# EAGLE design T01_Synth_Glove_Prototype_Board (EAGLE 7.1.0)
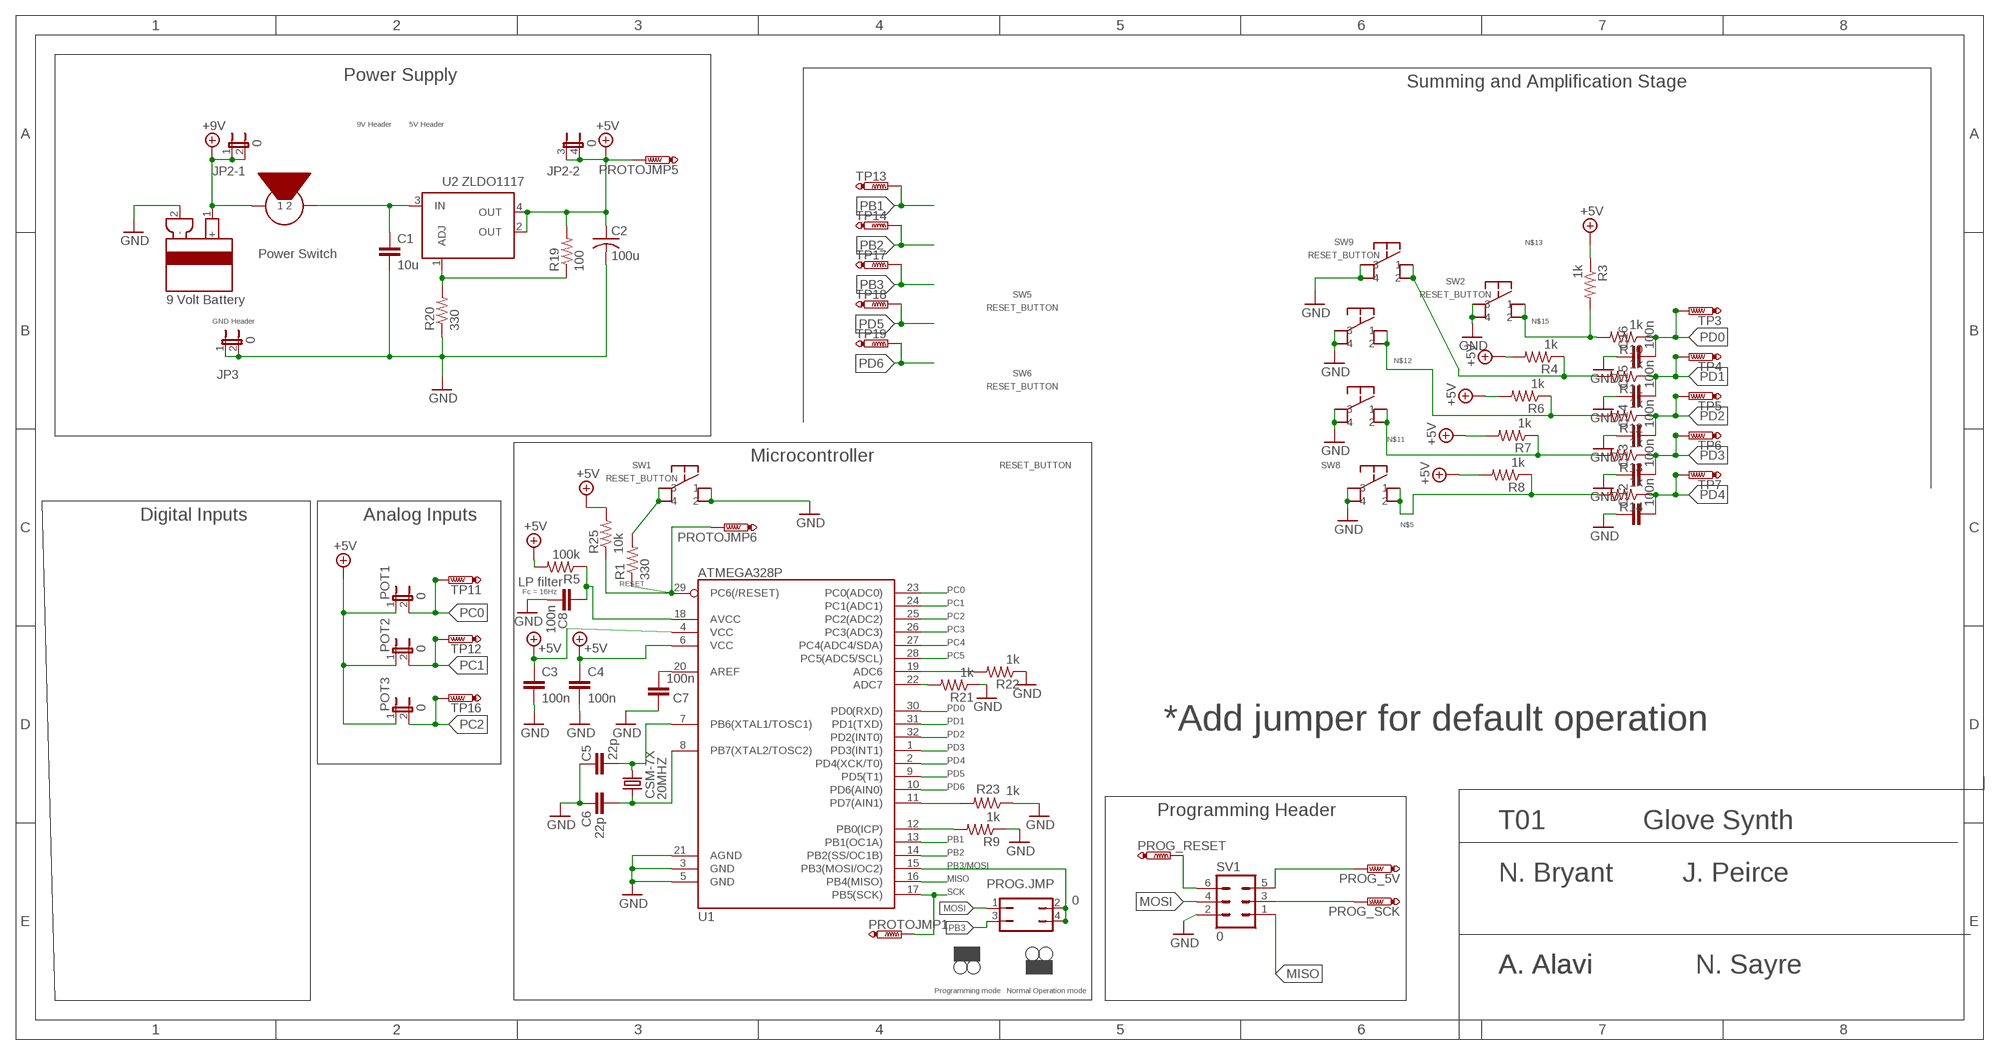
[diagram p0: schematic, sheet 1]

## Parts
20MHZ  CSM-7X  CSM-7X-DU  [CSM-7X-DU]
C1  10u  CAP0603-CAP  [0603-CAP]
C2  100u  C-US075-042X103  [C075-042X103]
C3  100n  CAP0603-CAP  [0603-CAP]
C4  100n  CAP0603-CAP  [0603-CAP]
C5  22p  CAP0603-CAP  [0603-CAP]
C6  22p  CAP0603-CAP  [0603-CAP]
C7  100n  CAP0603-CAP  [0603-CAP]
C8  100n  CAP0603-CAP  [0603-CAP]
C12  100n  CAP0603-CAP  [0603-CAP]
C13  100n  CAP0603-CAP  [0603-CAP]
C14  100n  CAP0603-CAP  [0603-CAP]
C15  100n  CAP0603-CAP  [0603-CAP]
C16  100n  CAP0603-CAP  [0603-CAP]
JP2  0  JP2QE  [JP2Q]
JP3  0  JP1E  [JP1]
POT1  0  JP1E  [JP1]
POT2  0  JP1E  [JP1]
POT3  0  JP1E  [JP1]
PROG.JMP  0  JP2Q  [JP2Q]
PROG_5V  PTR1B2,54  [B2,54]
PROG_RESET  PTR1B2,54  [B2,54]
PROG_SCK  PTR1B2,54  [B2,54]
PROTOJMP1  PTR1B2,54  [B2,54]
PROTOJMP5  PTR1B2,54  [B2,54]
PROTOJMP6  PTR1B2,54  [B2,54]
R1  330  RESISTOR0603  [0603-RES]
R3  1k  RESISTOR0603  [0603-RES]
R4  1k  RESISTOR0603  [0603-RES]
R5  100k  RESISTOR0603  [0603-RES]
R6  1k  RESISTOR0603  [0603-RES]
R7  1k  RESISTOR0603  [0603-RES]
R8  1k  RESISTOR0603  [0603-RES]
R9  1k  RESISTOR0603  [0603-RES]
R10  1k  RESISTOR0603  [0603-RES]
R11  1k  RESISTOR0603  [0603-RES]
R12  1k  RESISTOR0603  [0603-RES]
R13  1k  RESISTOR0603  [0603-RES]
R14  1k  RESISTOR0603  [0603-RES]
R19  100  RESISTOR0603  [0603-RES]
R20  330  RESISTOR0603  [0603-RES]
R21  1k  RESISTOR0603  [0603-RES]
R22  1k  RESISTOR0603  [0603-RES]
R23  1k  RESISTOR0603  [0603-RES]
R25  10k  RESISTOR0603  [0603-RES]
SV1  0  MA03-2  [MA03-2]
SW1  RESET_BUTTON  [RESET_BUTTON]
SW2  RESET_BUTTON  [RESET_BUTTON]
SW5  RESET_BUTTON  [RESET_BUTTON]
SW6  RESET_BUTTON  [RESET_BUTTON]
SW8  RESET_BUTTON  [RESET_BUTTON]
SW9  RESET_BUTTON  [RESET_BUTTON]
TP3  PTR1B2,54  [B2,54]
TP4  PTR1B2,54  [B2,54]
TP5  PTR1B2,54  [B2,54]
TP6  PTR1B2,54  [B2,54]
TP7  PTR1B2,54  [B2,54]
TP11  PTR1B2,54  [B2,54]
TP12  PTR1B2,54  [B2,54]
TP13  PTR1B2,54  [B2,54]
TP14  PTR1B2,54  [B2,54]
TP16  PTR1B2,54  [B2,54]
TP17  PTR1B2,54  [B2,54]
TP18  PTR1B2,54  [B2,54]
TP19  PTR1B2,54  [B2,54]
U1  ATMEGA328P  ATMEGA328_SMT  [TQFP32-08]
U2  ZLDO1117  [SOT223]
U$7  POWER_SWITCH  [JP1]
U$8  9VOLTBATTERY  [JP1]

## Nets
+5V: C2.1 C3.1 C4.1 JP2.3 JP2.4 POT1.1 POT2.1 POT3.1 PROTOJMP5.TP R3.1 R4.2 R5.2 R6.2 R7.2 R8.2 R19.2 R25.2 U1.4(VCC) U1.6(VCC) U2.2(OUT) U2.4(OUT)
+9V: JP2.1 JP2.2 U$7.1 U$8.1(+)
GND: C1.2 C2.2 C3.2 C4.2 C5.2 C6.2 C7.2 C8.2 C12.1 C13.1 C14.1 C15.1 C16.1 JP3.1 JP3.2 R9.1 R20.1 R21.1 R22.1 R23.1 SV1.2 SW1.1 SW1.2 SW2.3 SW2.4 SW5.3 SW5.4 SW6.3 SW6.4 SW8.3 SW8.4 SW9.3 SW9.4 U1.3(GND) U1.5(GND) U1.21(AGND) U$8.2(-)
JP3: PROG_SCK.TP SV1.3
MISO: SV1.1 U1.16(PB4(MISO))
MOSI: PROG.JMP.1 SV1.4
N$1: C7.1 U1.20(AREF)
N$2: PROG_5V.TP SV1.5
N$5: R8.1 R14.2 SW8.1 SW8.2
N$6: 20MHZ.1 C5.1 U1.7(PB6(XTAL1/TOSC1))
N$7: 20MHZ.2 C6.1 U1.8(PB7(XTAL2/TOSC2))
N$8: C8.1 R5.1 U1.18(AVCC)
N$9: R21.2 U1.22(ADC7)
N$10: R22.2 U1.19(ADC6)
N$11: R7.1 R13.2 SW6.1 SW6.2
N$12: R6.1 R12.2 SW5.1 SW5.2
N$13: R4.1 R11.2 SW9.1 SW9.2
N$15: R3.2 R10.2 SW2.1 SW2.2
N$17: R9.2 U1.12(PB0(ICP))
N$22: R1.2 SW1.3 SW1.4
N$37: R19.1 R20.2 U2.1(ADJ)
N$38: C1.1 U2.3(IN) U$7.2
PB1: TP13.TP U1.13(PB1(OC1A))
PB2: TP14.TP U1.14(PB2(SS/OC1B))
PB3: PROG.JMP.3 TP17.TP
PB3/MOSI: PROG.JMP.2 PROG.JMP.4 U1.15(PB3(MOSI/OC2))
PC0: POT1.2 TP11.TP U1.23(PC0(ADC0))
PC1: POT2.2 TP12.TP U1.24(PC1(ADC1))
PC2: POT3.2 TP16.TP U1.25(PC2(ADC2))
PC3: U1.26(PC3(ADC3))
PC4: U1.27(PC4(ADC4/SDA))
PC5: U1.28(PC5(ADC5/SCL))
PD0: C16.2 R10.1 TP3.TP U1.30(PD0(RXD))
PD1: C15.2 R11.1 TP4.TP U1.31(PD1(TXD))
PD2: C14.2 R12.1 TP5.TP U1.32(PD2(INT0))
PD3: C13.2 R13.1 TP6.TP U1.1(PD3(INT1))
PD4: C12.2 R14.1 TP7.TP U1.2(PD4(XCK/T0))
PD5: TP18.TP U1.9(PD5(T1))
PD6: TP19.TP U1.10(PD6(AIN0))
PD7: R23.2 U1.11(PD7(AIN1))
PJ4: PROG_RESET.TP SV1.6
RESET: PROTOJMP6.TP R1.1 R25.1 U1.29(PC6(/RESET))
SCK: PROTOJMP1.TP U1.17(PB5(SCK))

## Notes on the sheet
- Power Supply
- Summing and Amplification Stage
- 9V Header | 5V Header
- Power Switch
- GND Header
- Microcontroller
- Digital Inputs | Analog Inputs
- LP filter
- Fc = 16Hz
- *Add jumper for default operation
- Programming Header
- T01 | Glove Synth
- N. Bryant | J. Peirce
- A. Alavi | A. Alavi | N. Sayre
- Programming mode | Normal Operation mode

## Library data of the parts
20MHZ = crystal:CSM-7X-DU: SMD CRYSTAL Source: www.ecsxtal.com .. Crystal 3.6864MHz CSM_7X_DU.PDF; OC_FARNELL: unknown; OC_NEWARK: unknown
C1 C3-C8 C12-C16 = SparkFun-Capacitors:CAP: Capacitor Standard 0603 ceramic capacitor, and 0.1" leaded capacitor.
C2 = adafruit:C-US: CAPACITOR, American symbol
JP2 = jumper:JP2QE: JUMPER
JP3 POT1-POT3 = jumper:JP1E: JUMPER
PROG.JMP = jumper:JP2Q: JUMPER
PROG_5V PROG_RESET PROG_SCK PROTOJMP1 PROTOJMP5 PROTOJMP6 TP3-TP7 TP11-TP14 TP16-TP19 = testpad:PTR1: TEST PIN
R1 R3-R14 R19-R23 R25 = SparkFun-Resistors:RESISTOR: Resistor Basic schematic elements and footprints for 0603, 1206, and PTH resistors.
SV1 = con-lstb:MA03-2: PIN HEADER; OC_FARNELL: unknown; OC_NEWARK: unknown
SW1 SW2 SW5 SW6 SW8 SW9 = Synth_Glove:RESET_BUTTON
U1 = SparkFun-DigitalIC:ATMEGA328_SMT: 32-Pin Atmega328 part Commonly used on Arduino compatible boards Available in QFP and QFN packages TQFP is IC-09069 QFN is non-stock; PROD_ID: IC-09069
U2 = Synth_Glove:ZLDO1117
U$7 = Synth_Glove:POWER_SWITCH
U$8 = Synth_Glove:9VOLTBATTERY

## Board
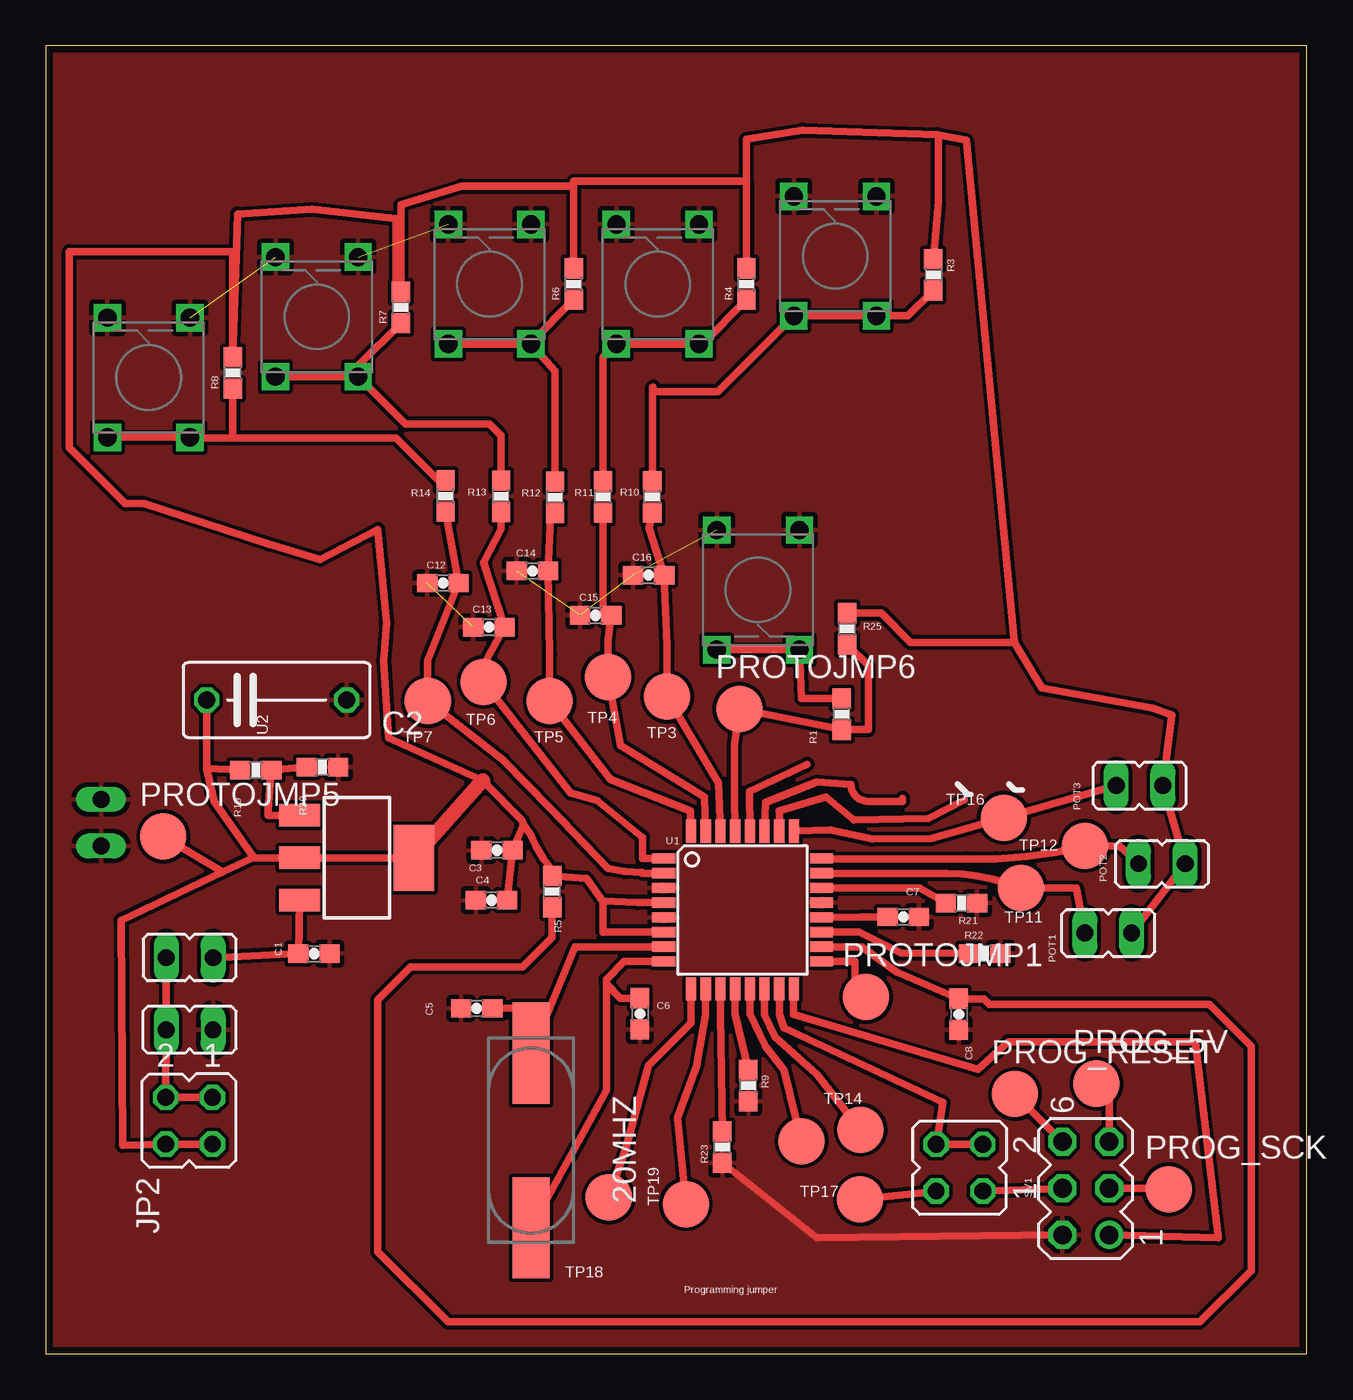
[diagram p1: board, top side]
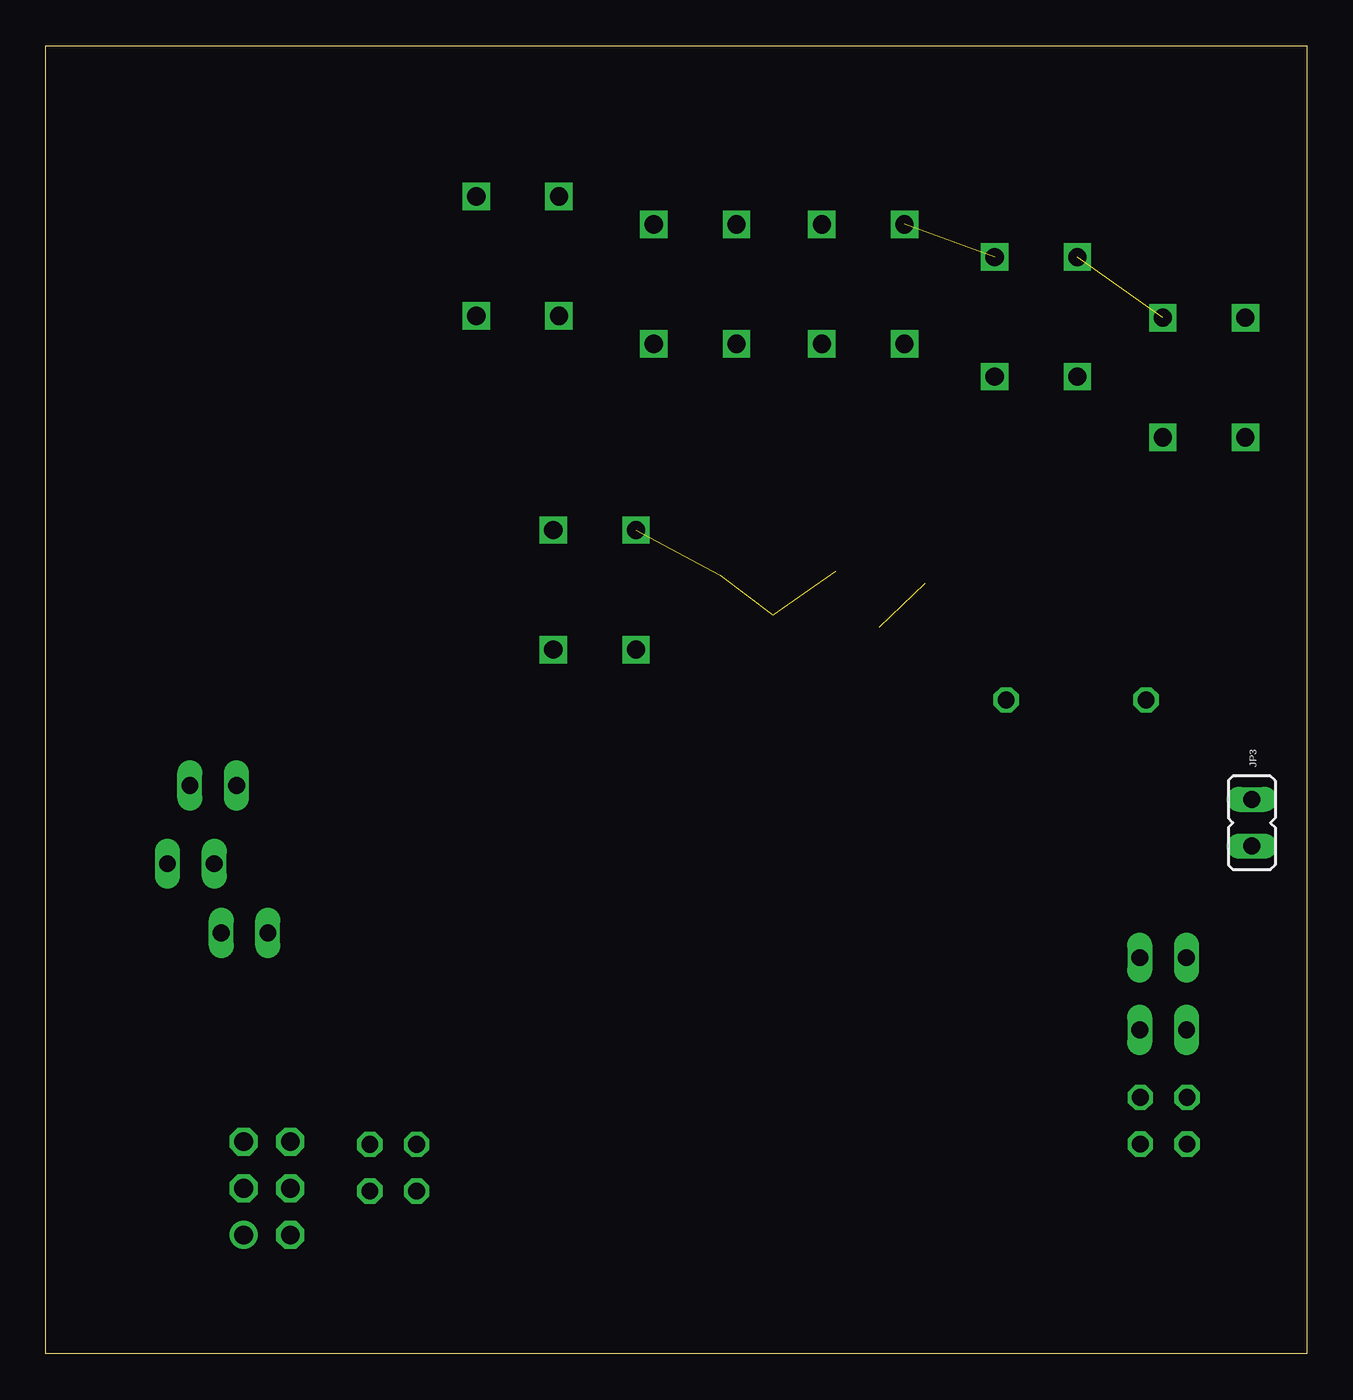
[diagram p2: board, bottom side, seen from below]

Size 68.58 x 71.12 mm. Coordinates in mm from the lower left corner, seen from the top.
Outline: 0,0 68.58,0 68.58,71.12 0,71.12 0,0
Copper layers (1*16): Top 0.0178mm / dielectric 59mil / Bottom 0.0178mm
Design rules "epl-lpkf": minimum track width 8mil, minimum drill 0.35mm, track to track 8mil, track to pad 8mil, pad to pad 8mil, via to via 8mil, smd to smd 8mil, copper to edge 15mil, drill to drill 15mil, minimum pad ring 8mil, minimum via ring 8mil, stop-mask expansion 3mil, vias tented up to drill 0mil, thermal gap 10mil

### Footprints (pad centres in the part's own frame; a part is rotated, then mirrored left to right if it is on the bottom)
CSM-7X-DU = smd 5.5 x 2: 1 -4.75,0; 2 4.75,0
0603-CAP = smd 1.1 x 1: 1 -0.85,0; 2 0.85,0
C075-042X103 = drill 0.914 octagon: 1 -3.81,0; 2 3.81,0
JP2Q = drill 0.914 octagon: 1 -1.27,-1.27; 2 1.27,-1.27; 3 -1.27,1.27; 4 1.27,1.27
JP1 = drill 0.914 long: 1 0,-1.27; 2 0,1.27
B2,54 = smd 2.54 x 2.54: TP 0,0
0603-RES = smd 1.1 x 1: 1 -0.85,0; 2 0.85,0
MA03-2 = drill 1.016: 1 -2.54,-1.27 | drill 1.016 octagon: 2 -2.54,1.27; 3 0,-1.27; 4 0,1.27; 5 2.54,-1.27; 6 2.54,1.27
RESET_BUTTON = drill 0.991 square: 1 3.251,2.248; 2 3.251,-2.248; 3 -3.251,2.248; 4 -3.251,-2.248
TQFP32-08 = smd 1.27 x 0.559: 1 -4.293,2.8; 2 -4.293,2; 3 -4.293,1.2; 4 -4.293,0.4; 5 -4.293,-0.4; 6 -4.293,-1.2; 7 -4.293,-2; 8 -4.293,-2.8; 17 4.293,-2.8; 18 4.293,-2; 19 4.293,-1.2; 20 4.293,-0.4; 21 4.293,0.4; 22 4.293,1.2; 23 4.293,2; 24 4.293,2.8 | smd 0.559 x 1.27: 9 -2.8,-4.293; 10 -2,-4.293; 11 -1.2,-4.293; 12 -0.4,-4.293; 13 0.4,-4.293; 14 1.2,-4.293; 15 2,-4.293; 16 2.8,-4.293; 25 2.8,4.293; 26 2,4.293; 27 1.2,4.293; 28 0.4,4.293; 29 -0.4,4.293; 30 -1.2,4.293; 31 -2,4.293; 32 -2.8,4.293
SOT223 = smd 1.219 x 2.235: 1 -2.311,-3.099; 2 0,-3.099; 3 2.311,-3.099 | smd 3.6 x 2.2: 4 0,3.099

### Placement (x,y rotation side)
20MHZ  26.38,11.59 270 top
C1  14.58,21.75 0 top
C2  12.55,35.55 0 top
C3  24.53,27.38 180 top
C4  24.23,24.66 180 top
C5  23.43,18.77 180 top
C6  32.3,18.48 270 top
C7  46.63,23.75 0 top
C8  49.65,18.45 270 top
C12  21.59,41.91 0 top
C13  24.09,39.51 0 top
C14  26.46,42.57 0 top
C15  29.89,40.16 0 top
C16  32.78,42.33 0 top
JP2  7.79,12.66 180 top
JP3  3,28.87 0 bottom
POT1  57.78,22.88 90 top
POT2  60.7,26.65 90 top
POT3  59.48,30.9 90 top
PROG.JMP  49.69,10.11 90 top
PROG_5V  57.14,14.68 0 top
PROG_RESET  52.71,14.12 0 top
PROG_SCK  61.07,8.93 0 top
PROTOJMP1  44.61,19.4 0 top
PROTOJMP5  6.38,28.12 0 top
PROTOJMP6  37.71,35.07 0 top
R1  43.29,34.78 90 top
R3  48.26,58.67 270 top
R4  38.1,58.17 90 top
R5  27.53,25.13 90 top
R6  28.7,58.17 90 top
R7  19.3,56.9 90 top
R8  10.16,53.34 90 top
R9  38.21,14.57 90 top
R10  32.98,46.59 90 top
R11  30.3,46.59 90 top
R12  27.69,46.58 90 top
R13  24.75,46.63 90 top
R14  21.74,46.64 90 top
R19  11.41,31.73 180 top
R20  15.04,31.89 180 top
R21  49.8,24.5 180 top
R22  51.06,21.75 180 top
R23  36.79,11.22 90 top
R25  43.58,39.41 90 top
SV1  56.56,8.98 90 top
SW1  38.73,41.54 90 top
SW2  42.93,59.69 270 top
SW5  24.13,58.17 270 top
SW6  14.73,56.39 270 top
SW8  5.59,53.09 270 top
SW9  33.27,58.17 270 top
TP3  33.79,35.73 180 top
TP4  30.56,36.8 180 top
TP5  27.4,35.49 180 top
TP6  23.81,36.53 180 top
TP7  20.77,35.49 180 top
TP11  53.03,25.32 0 top
TP12  56.51,27.61 0 top
TP13  41.09,11.55 0 top
TP14  44.31,12.17 0 top
TP16  52.1,29.13 0 top
TP17  44.28,8.38 0 top
TP18  30.61,8.5 0 top
TP19  34.8,8.13 0 top
U1  37.89,24.13 0 top
U2  16.9,26.96 270 top
U$7  7.82,21.53 270 top
U$8  7.81,17.61 270 top

### Tracks (layer width: path | path; a pad name or v marks a point on that pad's centre or on a via)
+5V
  Top 0.406: U1.4 32.16,24.53 30.28,24.61 | 30.28,24.61 29.4,25.85 R5.2 27.74,26.05 27.06,26.91 26.65,27.59 26.38,28.17 25.96,28.78 | 25.96,28.78 25.91,29 23.75,31.16 18.65,33.49 18.36,37.67 18.53,39.73 18.04,44.83 14.91,43.19 12.12,44.02 5.33,46.23 4.32,46.23 1.27,49.28 1.27,59.94 10.16,59.94 R8.2 10.41,61.98 14.48,62.23 19.05,61.72 19.05,58 R7.2 19.3,62.48 22.61,63.5 28.7,63.5 | 25.96,28.78 C3.1 C4.1 | 11.23,26.96 U2.2 U2.4 | 11.23,26.96 11.23,27.06 9.14,30.02 8.73,31.82 | 8.73,31.82 C2.1 | R19.2 8.73,31.82 | 11.23,26.96 9.62,26.2 | 9.62,26.2 4.08,23.56 4.17,11.31 JP2.4 JP2.3 | PROTOJMP5.TP 9.62,26.2 | 52.68,38.67 50.06,65.99 48.48,66.29 | 52.68,38.67 54.17,36.2 60.17,35.12 61.23,34.74 POT3.1 POT2.1 POT1.1 | U1.6 30.32,22.93 30.31,22.91 30.31,24.58 30.28,24.61 | R25.2 45.43,40.26 47.03,38.67 52.68,38.67 | 28.7,63.5 28.7,63.75 38.1,63.75 | 28.7,63.5 R6.2 | 38.1,63.75 R4.2 | R3.1 48.53,62.63 48.53,66.25 48.48,66.29 | 38.1,63.75 38.1,66.04 41.15,66.55 48.48,66.29
  Top 0.813: U2.4 23.75,31.16
+9V
  Top 0.406: U$7.1 U$8.1 JP2.2 JP2.1
GND  (6 unrouted)
  Top 0.406: R23.1 41.93,6.29 SV1.2
  pour Top: 0,0 68.58,0 68.58,71.12 0,71.12
JP3
  Top 0.406: SV1.3 61.01,8.98 PROG_SCK.TP
MISO
  Top 0.406: U1.16 40.67,19.83 40.67,18.45 50.69,15.45 52.34,16.96 62.5,16.96 63.77,6.29 SV1.1
MOSI
  Top 0.406: PROG.JMP.1 SV1.4
N$1
  Top 0.406: U1.20 44.36,23.75 C7.1
N$2
  Top 0.406: SV1.5 57.83,14 PROG_5V.TP
N$5
  Top 0.406: SW8.2 SW8.1 7.89,49.78 10.16,49.78 | R14.2 21.34,47.49 19.05,49.78 10.16,49.78 | R8.1 10.16,49.78
N$6
  Top 0.406: U1.7 28.79,22.13 20MHZ.1 26.42,18.84 C5.1
N$7
  Top 0.406: U1.8 31.44,21.33 30.48,20.36 30.48,20.11 | 30.48,20.11 30.48,14.31 20MHZ.2 | C6.1 31.26,19.33 30.48,20.11
N$8
  Top 0.406: U1.18 44.39,22.11 46.25,20.77 C8.1 51.02,19.3 51.33,18.99 63.26,18.99 65.55,16.7 65.55,4.51 62.76,1.72 21.86,1.72 18.05,5.53 18.05,19.24 19.83,21.02 25.93,21.02 27.53,22.63 R5.1
N$9
  Top 0.406: U1.22 44.7,25.32 47.52,25.34 R21.2
N$10
  Top 0.406: U1.19 44.22,22.94 46.5,21.78 R22.2
N$11
  Top 0.406: SW6.2 SW6.1 | R13.2 24.75,49.92 24.13,50.55 19.57,50.55 SW6.1 | SW6.1 16.98,53.72 R7.1
N$12
  Top 0.406: SW5.2 SW5.1 | R12.2 27.69,53.43 SW5.1 | SW5.1 26.38,54.99 R6.1
N$13
  Top 0.406: R11.2 30.3,54.19 SW9.2 SW9.1 35.7,54.91 R4.1
N$15
  Top 0.406: R10.2 32.98,52.32 | 32.98,52.32 32.98,52.53 33.02,52.58 | 32.98,52.32 36.56,52.32 SW2.2 SW2.1 46.88,56.44 R3.2
N$17
  Top 0.406: U1.12 37.49,18.47 R9.2
N$22
  Top 0.406: SW1.3 SW1.4 41.1,35.63 R1.2
N$37
  Top 0.406: U2.1 12.08,29.27 12.08,29.58 R19.1 R20.2
N$38
  Top 0.406: U2.3 C1.1 U$7.2
PB1
  Top 0.406: U1.13 38.28,18.47 39.13,16.7 40.15,15.43 TP13.TP
PB2
  Top 0.406: U1.14 | U1.14 39.09,18.43 39.64,17.21 41.93,15.18 TP14.TP
PB3
  Top 0.406: PROG.JMP.3 TP17.TP
PB3/MOSI
  Top 0.406: U1.15 39.89,18.45 39.9,18.45 40.15,17.72 48.79,13.65 PROG.JMP.4 PROG.JMP.2
PC0
  Top 0.406: U1.23 48.99,26.12 arc-22 TP11.TP 56.05,25.32 POT1.2
PC1
  Top 0.406: U1.24 42.2,26.91 50.06,26.91 arc16 TP12.TP 58.38,27.61 POT2.2
PC2
  Top 0.406: U1.25 42.67,28.49 44.96,27.98 48.15,28.01 TP16.TP POT3.2
PC3
  Top 0.406: U1.26 39.89,29.5 39.88,29.51 42.42,30.27 43.94,29.03 48,29.09 49.95,30.11
PC4
  Top 0.406: U1.27 39.13,29.96 41.95,31.08 43.78,30.96 arc90 44.71,30.04 46.59,30.04 46.59,30.2
PC5
  Top 0.406: U1.28 38.28,30.58 41.4,32.05
PD0
  Top 0.406: U1.30 36.58,31.03 TP3.TP 33.79,38.55 C16.2 32.79,44.91 R10.1
PD1
  Top 0.406: U1.31 35.81,30.27 31.24,33.06 TP4.TP 30.56,38.79 C15.2 30.3,40.36 R11.1
PD2
  Top 0.406: U1.32 35.05,28.42 35.05,29.51 30.71,31.23 TP5.TP 27.4,38.06 C14.2 27.45,45.49 R12.1
PD3
  Top 0.406: U1.1 32.45,26.93 32.45,28.08 29.97,30.07 28.54,30.48 TP6.TP 23.81,37.44 C13.2 23.8,43.02 24.75,44.84 R13.1
PD4
  Top 0.406: U1.2 32.42,26.13 32.42,26.16 31.47,26.21 30.57,26.37 27.42,29.68 24.86,32.29 TP7.TP 20.77,37.7 C12.2 R14.1
PD5
  Top 0.406: U1.9 35.09,17.99 32.78,15.69 31.51,11.11 TP18.TP
PD6
  Top 0.406: U1.10 35.88,19.83 35.88,18.43 35.38,15.62 34.34,12.81 TP19.TP
PD7
  Top 0.406: U1.11 36.68,18.43 R23.2
PJ4
  Top 0.406: PROG_RESET.TP 52.71,14.1 SV1.6
RESET
  Top 0.406: U1.29 37.45,30.39 37.45,33.13 PROTOJMP6.TP R1.1 44.72,33.93 44.72,37.42 R25.1
SCK
  Top 0.406: U1.17 43.99,21.33 43.99,20.03 PROTOJMP1.TP

### Text on the board
tPlace: Programming jumper